# EAGLE schematic proiect (EAGLE 9.6.2)
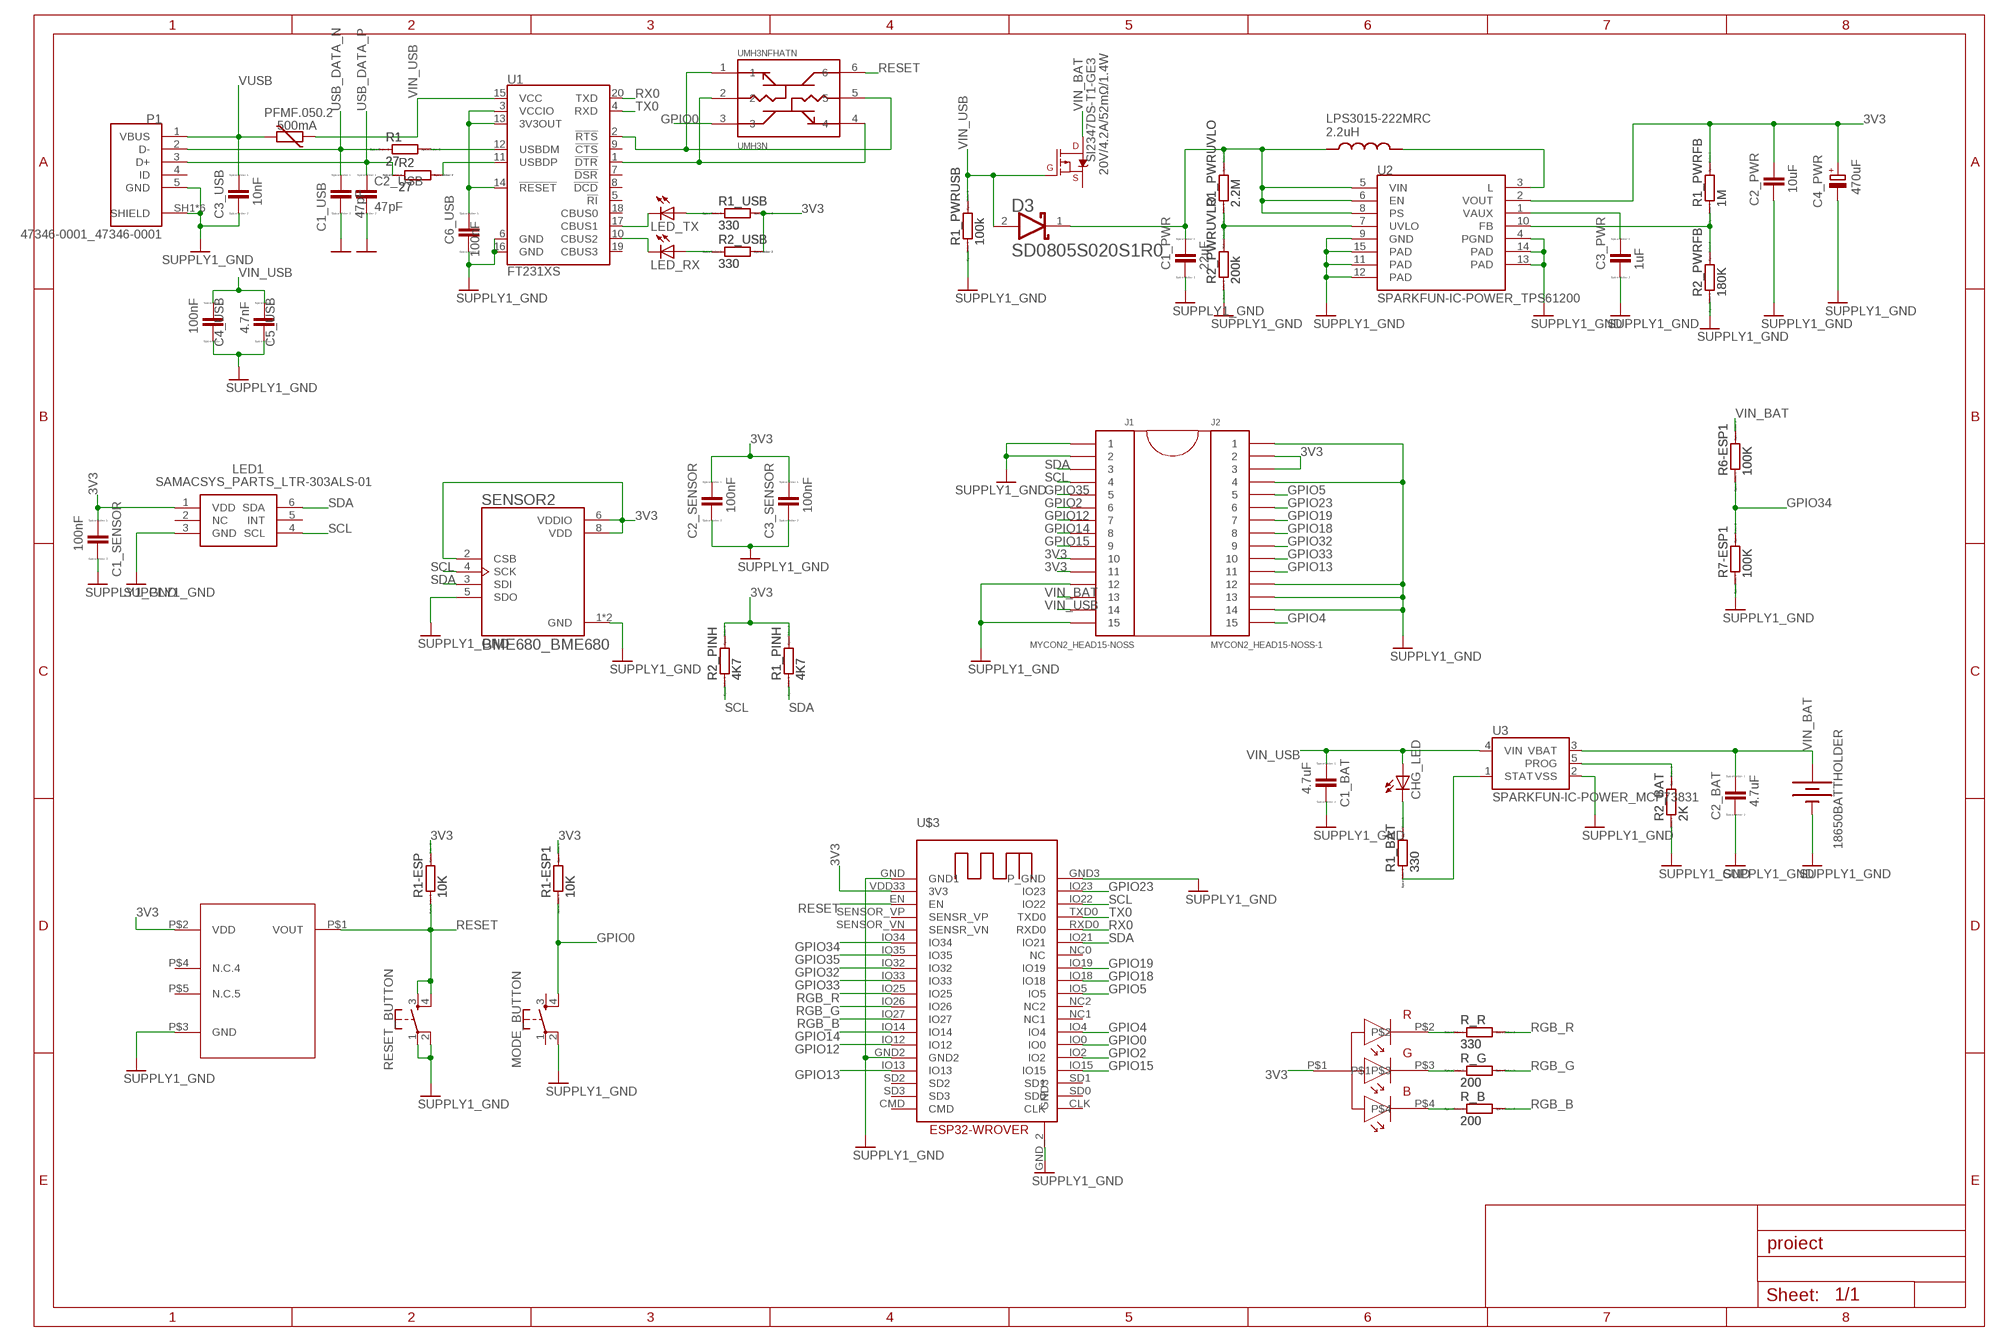
[diagram p0: schematic, sheet 1]

## Parts
18650BATTHOLDER  BATTERY-18650  [BATTERY_18650-HOLDER]
C1_BAT  4.7uF  EAGLE-LTSPICE_CC0402  [EAGLE-LTSPICE_C0402]
C1_PWR  22uF  EAGLE-LTSPICE_CC0402  [EAGLE-LTSPICE_C0402]
C1_SENSOR  100nF  EAGLE-LTSPICE_CC0402  [EAGLE-LTSPICE_C0402]
C1_USB  47pF  EAGLE-LTSPICE_CC0402  [EAGLE-LTSPICE_C0402]
C2_BAT  4.7uF  EAGLE-LTSPICE_CC0402  [EAGLE-LTSPICE_C0402]
C2_PWR  10uF  RCL_C-EUC0603  [RCL_C0603]
C2_SENSOR  100nF  EAGLE-LTSPICE_CC0402  [EAGLE-LTSPICE_C0402]
C2_USB  47pF  EAGLE-LTSPICE_CC0402  [EAGLE-LTSPICE_C0402]
C3_PWR  1uF  EAGLE-LTSPICE_CC0402  [EAGLE-LTSPICE_C0402]
C3_SENSOR  100nF  EAGLE-LTSPICE_CC0402  [EAGLE-LTSPICE_C0402]
C3_USB  10nF  EAGLE-LTSPICE_CC0402  [EAGLE-LTSPICE_C0402]
C4_PWR  470uF  RCL_CPOL-EUD/7343-31R  [RCL_D/7343-31R]
C4_USB  100nF  EAGLE-LTSPICE_CC0402  [EAGLE-LTSPICE_C0402]
C5_USB  4.7nF  EAGLE-LTSPICE_CC0402  [EAGLE-LTSPICE_C0402]
C6_USB  100nF  EAGLE-LTSPICE_CC0402  [EAGLE-LTSPICE_C0402]
CHG_LED  ADAFRUIT_LEDCHIP-LED0603  [ADAFRUIT_CHIP-LED0603]
D3  AVX---SD0805S020S1R0_AVX_SD0805S020S1R0AVX_SD0805S020S1R0_0_0  [AVX---SD0805S020S1R0_AVX_SD0805S020S1R0_0]
J1  MYCON2_HEAD15-NOSS  [MYCON2_HEAD15-NOSS]
J2  MYCON2_HEAD15-NOSS-1  [MYCON2_HEAD15-NOSS-1]
LED1  SAMACSYS_PARTS_LTR-303ALS-01  [SAMACSYS_PARTS_LTR303ALS01]
LED_RX  ADAFRUIT_LEDCHIP-LED0603  [ADAFRUIT_CHIP-LED0603]
LED_TX  ADAFRUIT_LEDCHIP-LED0603  [ADAFRUIT_CHIP-LED0603]
MODE_BUTTON  SPARKFUN-SWITCHES_MOMENTARY-SWITCH-SPST-2-SMD-4.6X2.8MM  [SPARKFUN-SWITCHES_TACTILE_SWITCH_SMD_4.6X2.8MM]
P1  47346-0001_47346-0001  [47346-0001_MOLEX_47346-0001]
PFMF.050.2  500mA  VARISTOR_VARISTORCN1812  [VARISTOR_CT/CN1812]
R1  27  EAGLE-LTSPICE_RR0402  [EAGLE-LTSPICE_R0402]
R1-ESP  10K  EAGLE-LTSPICE_RR0402  [EAGLE-LTSPICE_R0402]
R1-ESP1  10K  EAGLE-LTSPICE_RR0402  [EAGLE-LTSPICE_R0402]
R1_BAT  330  EAGLE-LTSPICE_RR0402  [EAGLE-LTSPICE_R0402]
R1_PINH  4K7  EAGLE-LTSPICE_RR0402  [EAGLE-LTSPICE_R0402]
R1_PWRFB  1M  EAGLE-LTSPICE_RR0402  [EAGLE-LTSPICE_R0402]
R1_PWRUSB  100k  EAGLE-LTSPICE_RR0402  [EAGLE-LTSPICE_R0402]
R1_PWRUVLO  2.2M  EAGLE-LTSPICE_RR0402  [EAGLE-LTSPICE_R0402]
R1_USB  330  EAGLE-LTSPICE_RR0402  [EAGLE-LTSPICE_R0402]
R2  27  EAGLE-LTSPICE_RR0402  [EAGLE-LTSPICE_R0402]
R2_BAT  2K  EAGLE-LTSPICE_RR0402  [EAGLE-LTSPICE_R0402]
R2_PINH  4K7  EAGLE-LTSPICE_RR0402  [EAGLE-LTSPICE_R0402]
R2_PWRFB  180K  EAGLE-LTSPICE_RR0402  [EAGLE-LTSPICE_R0402]
R2_PWRUVLO  200k  EAGLE-LTSPICE_RR0402  [EAGLE-LTSPICE_R0402]
R2_USB  330  EAGLE-LTSPICE_RR0402  [EAGLE-LTSPICE_R0402]
R6-ESP1  100K  EAGLE-LTSPICE_RR0402  [EAGLE-LTSPICE_R0402]
R7-ESP1  100K  EAGLE-LTSPICE_RR0402  [EAGLE-LTSPICE_R0402]
R_B  200  EAGLE-LTSPICE_RR0402  [EAGLE-LTSPICE_R0402]
R_G  200  EAGLE-LTSPICE_RR0402  [EAGLE-LTSPICE_R0402]
R_R  330  EAGLE-LTSPICE_RR0402  [EAGLE-LTSPICE_R0402]
RESET_BUTTON  SPARKFUN-SWITCHES_MOMENTARY-SWITCH-SPST-2-SMD-4.6X2.8MM  [SPARKFUN-SWITCHES_TACTILE_SWITCH_SMD_4.6X2.8MM]
SENSOR2  BME680_BME680  [BME680_PSON80P300X300X100-8N]
SI2347DS-T1-GE3  20V/4.2A/52mΩ/1.4W  SPARKFUN-DISCRETESEMI_MOSFET_PCH-DMG2305UX-7  [SPARKFUN-DISCRETESEMI_SOT23-3]
U1  FT231XS  SPARKFUN-IC-COMMS_FT231XS  [SPARKFUN-IC-COMMS_SSOP20_L]
U2  SPARKFUN-IC-POWER_TPS61200  [SPARKFUN-IC-POWER_QFN-10_PAD]
U3  SPARKFUN-IC-POWER_MCP73831  [SPARKFUN-IC-POWER_SOT23-5]
U$1  LPS3015_LPS3015  [LPS3015_LPS3015-222MRC]
U$2  BD48E27G-TR_BD48E27G-TR  [BD48E27G-TR_SSOP5]
U$3  ESP32-WROVER_ESP32-WROVER  [ESP32-WROVER_ESP32-WROVER]
U$4  150202M153130_150202M153130-RGB  [150202M153130_150202M153130]
UMH3NFHATN  UMH3N_UMH3N  [UMH3N_SOP65P210X100-6N]

## Nets
3V3: C1_SENSOR.1 C2_PWR.1 C2_SENSOR.1 C3_SENSOR.1 C4_PWR.+ J1.10 J1.11 J2.2 J2.3 LED1.1(VDD) R1-ESP1.2 R1-ESP.2 R1_PINH.2 R1_PWRFB.2 R1_USB.2 R2_PINH.2 R2_USB.2 SENSOR2.2(CSB) SENSOR2.6(VDDIO) SENSOR2.8(VDD) U2.2(VOUT) U$2.P$2(VDD) U$3.VDD33(3V3) U$4.P$1
GND: 18650BATTHOLDER.GND@1(-) C1_BAT.2 C1_PWR.2 C1_SENSOR.2 C1_USB.2 C2_BAT.2 C2_PWR.2 C2_SENSOR.2 C2_USB.2 C3_PWR.2 C3_SENSOR.2 C3_USB.2 C4_PWR.- C4_USB.2 C5_USB.2 C6_USB.2 J1.1 J1.2 J1.12 J1.15 J2.1 J2.4 J2.12 J2.13 J2.14 LED1.3(GND) MODE_BUTTON.2 P1.5(GND) P1.SH1(SHIELD) P1.SH2(SHIELD) P1.SH3(SHIELD) P1.SH4(SHIELD) P1.SH5(SHIELD) P1.SH6(SHIELD) R1_PWRUSB.1 R2_BAT.1 R2_PWRFB.1 R2_PWRUVLO.1 R7-ESP1.1 RESET_BUTTON.1 RESET_BUTTON.2 SENSOR2.1(GND) SENSOR2.5(SDO) SENSOR2.7(GND) U1.6(GND) U1.16(GND) U2.4(PGND) U2.9(GND) U2.11(PAD) U2.12(PAD) U2.13(PAD) U2.14(PAD) U2.15(PAD) U3.2(VSS) U$2.P$3(GND) U$3.GND2 U$3.GND3(P_GND) U$3.GND(GND1) U$3.GND_2(GND3) ; supply symbol labelled SUPPLY1_GND
GPIO0: MODE_BUTTON.4 R1-ESP1.1 U$3.IO0 UMH3NFHATN.3
GPIO2: J1.6 U$3.IO2
GPIO4: J2.15 U$3.IO4
GPIO5: J2.5 U$3.IO5
GPIO12: J1.7 U$3.IO12
GPIO13: J2.11 U$3.IO13
GPIO14: J1.8 U$3.IO14
GPIO15: J1.9 U$3.IO15
GPIO18: J2.8 U$3.IO18
GPIO19: J2.7 U$3.IO19
GPIO23: J2.6 U$3.IO23
GPIO32: J2.9 U$3.IO32
GPIO33: J2.10 U$3.IO33
GPIO34: R6-ESP1.1 R7-ESP1.2 U$3.IO34
GPIO35: J1.5 U$3.IO35
N$1: U1.2(!RTS) UMH3NFHATN.1 UMH3NFHATN.5
N$2: R1.2 U1.12(USBDM)
N$3: U1.1(!DTR) UMH3NFHATN.2 UMH3NFHATN.4
N$4: LED_TX.C U1.17(CBUS1)
N$5: R2.2 U1.11(USBDP)
N$6: C6_USB.1 U1.3(VCCIO) U1.13(3V3OUT) U1.14(!RESET)
N$7: LED_TX.A R1_USB.1
N$8: U2.3(L) U$1.P$2
N$9: LED_RX.A R2_USB.1
N$10: LED_RX.C U1.10(CBUS2)
N$11: R1_PWRUVLO.1 R2_PWRUVLO.2 U2.7(UVLO)
N$12: C3_PWR.1 U2.1(VAUX)
N$13: R1_PWRFB.1 R2_PWRFB.2 U2.10(FB)
N$14: R_R.1 U$4.P$2
N$15: CHG_LED.C R1_BAT.2
N$16: R1_BAT.1 U3.1(STAT)
N$17: R2_BAT.2 U3.5(PROG)
N$18: R_G.1 U$4.P$3
N$19: R_B.1 U$4.P$4
RESET: R1-ESP.1 RESET_BUTTON.3 RESET_BUTTON.4 U$2.P$1(VOUT) U$3.EN UMH3NFHATN.6
RGB_B: R_B.2 U$3.IO27
RGB_G: R_G.2 U$3.IO26
RGB_R: R_R.2 U$3.IO25
RX0: U1.20(TXD) U$3.RXD0
SCL: J1.4 LED1.4(SCL) R2_PINH.1 SENSOR2.4(SCK) U$3.IO22
SDA: J1.3 LED1.6(SDA) R1_PINH.1 SENSOR2.3(SDI) U$3.IO21
TX0: U1.4(RXD) U$3.TXD0
USB_DATA_N: C1_USB.1 P1.2(D-) R1.1
USB_DATA_P: C2_USB.1 P1.3(D+) R2.1
VIN: C1_PWR.1 D3.1(CATHODE) R1_PWRUVLO.2 U2.5(VIN) U2.6(EN) U2.8(PS) U$1.P$1
VIN_BAT: 18650BATTHOLDER.PWR@1(+) C2_BAT.1 J1.13 R6-ESP1.2 SI2347DS-T1-GE3.3(D) U3.3(VBAT)
VIN_USB: C1_BAT.1 C4_USB.1 C5_USB.1 CHG_LED.A D3.2(ANODE) J1.14 PFMF.050.2.1 R1_PWRUSB.2 SI2347DS-T1-GE3.1(G) U1.15(VCC) U3.4(VIN)
VUSB: C3_USB.1 P1.1(VBUS) PFMF.050.2.2
Unconnected: LED1.2(NC) LED1.5(INT) MODE_BUTTON.1 MODE_BUTTON.3 P1.4(ID) SI2347DS-T1-GE3.2(S) U1.5(!RI) U1.7(!DSR) U1.8(!DCD) U1.9(!CTS) U1.18(CBUS0) U1.19(CBUS3) U$2.P$4(N.C.4) U$2.P$5(N.C.5) U$3.CLK U$3.CMD U$3.NC0(NC) U$3.NC1 U$3.NC2 U$3.SD0 U$3.SD1 U$3.SD2 U$3.SD3 U$3.SENSOR_VN(SENSR_VN) U$3.SENSOR_VP(SENSR_VP)

## Library data of the parts
18650BATTHOLDER = SparkFun-Batteries:BATTERY: Battery - Single Cell A variety of battery chemistries, sizes, and footprints. Device List: 20MM_PTH - Coin Cell Battery Holder - 20mm (PTH) <https://www.sparkfun.com/products/783> 20MM_PTH_KIT- Coin Cell battery Holder - 20 mm (PTH) <http://www.sparkfun.com/products/783>kit version with special mask 6.8MM_PTH - Coin Cell Battery Holder - 6.8MM(SMD) <https://www.digikey.com/product-detail/en/seiko-instruments/MS621FE-FL11E/728-1057-ND/1889208?WT.srch=1&gclid=CNOQ5a6LzdQCFZS2wAodXCkE0g> 12MM_SMD - Coin Cell Battery Holder - 12mm (SMD) <https://www.sparkfun.com/products/10592> 12MM_PTH - Coin Cell Battery Holder - 12mm (PTH) <https://www.sparkfun.com/products/7948> 20MM_SMD - 20mm Coin Cell Battery Holder (SMD) (2 legs) Used on the Big Time Watch Kit <https://www.sparkfun.com/products/11734> 20MM_SMD_4LEGS - Coin Cell Battery Holder - 20mm (SMD) <https://www.sparkfun.com/products/11892> 20MM_SMD_4LEGS_OVERPASTE - Coin Cell Battery Holder - 20mm (SMD) <https://www.sparkfun.com/products/11892> (Over-paste on the legs) 24.5MM_PTH - Coin Cell Battery Holder - 24.5mm (PTH) <https://www.sparkfun.com/products/8863> 9V - 9V Battery Holder - PC Mount Used on the SparkFun SparkPunk Sound Kit <https://www.sparkfun.com/products/11177> and SparkFun SparkPunk Sequencer Kit <https://www.sparkfun.com/products/12707> 18650 - Battery Holder - 18650 (PTH) <https://www.sparkfun.com/products/13113> AA - Battery Holder - 1xAA (PTH) <https://www.sparkfun.com/products/7949> AAA - Battery Holder - 1xAAA (PTH) <https://www.sparkfun.com/products/12718> AA_KIT - Battery Holder - 1xAA (PTH) <https://www.sparkfun.com/products/7949> Special kit package - pads only have exposed copper on one side of the board. AAA_KIT - Battery Holder - 1xAAA (PTH) <https://www.sparkfun.com/products/12718> Special kit package - pads only have exposed copper on one side of the board.; PROD_ID: BATT-12327; SF_SKU: PRT-13113
C1_BAT C1_PWR C1_SENSOR C1_USB C2_BAT C2_SENSOR C2_USB C3_PWR C3_SENSOR C3_USB C4_USB C5_USB C6_USB = ESP32_WROVER:EAGLE-LTSPICE_C: CAPACITOR, European symbol; SPICEMODEL: NONE; SPICEPREFIX: C
C2_PWR = ESP32_WROVER:RCL_C-EU: CAPACITOR, European symbol; SPICEPREFIX: C
C4_PWR = ESP32_WROVER:RCL_CPOL-EU: POLARIZED CAPACITOR, European symbol; SPICEPREFIX: C
CHG_LED LED_RX LED_TX = ESP32_WROVER:ADAFRUIT_LED: LED OSRAM: - CHIPLED LG R971, LG N971, LY N971, LG Q971, LY Q971, LO R971, LY R971 LH N974, LH R974 LS Q976, LO Q976, LY Q976 LO Q996 - Hyper CHIPLED LW Q18S LB Q993, LB Q99A, LB R99A - SideLED LS A670, LO A670, LY A670, LG A670, LP A670 LB A673, LV A673, LT A673, LW A673 LH A674 LY A675 LS A676, LA A676, LO A676, LY A676, LW A676 LS A679, LY A679, LG A679 - Hyper Micro SIDELED® LS Y876, LA Y876, LO Y876, LY Y876 LT Y87S - SmartLED LW L88C, LW L88S LB L89C, LB L89S, LG L890 LS L89K, LO L89K, LY L89K LS L896, LA L896, LO L896, LY L896 - TOPLED LS T670, LO T670, LY T670, LG T670, LP T670 LSG T670, LSP T670, LSY T670, LOP T670, LYG T670 LG T671, LOG T671, LSG T671 LB T673, LV T673, LT T673, LW T673 LH T674 LS T676, LA T676, LO T676, LY T676, LB T676, LH T676, LSB T676, LW T676 LB T67C, LV T67C, LT T67C, LS T67K, LO T67K, LY T67K, LW E67C LS E67B, LA E67B, LO E67B, LY E67B, LB E67C, LV E67C, LT E67C LW T67C LS T679, LY T679, LG T679 LS T770, LO T770, LY T770, LG T770, LP T770 LB T773, LV T773, LT T773, LW T773 LH T774 LS E675, LA E675, LY E675, LS T675 LS T776, LA T776, LO T776, LY T776, LB T776 LHGB T686 LT T68C, LB T68C - Hyper Mini TOPLED® LB M676 - Mini TOPLED Santana® LG M470 LS M47K, LO M47K, LY M47K Source: http://www.osram.convergy.de/
D3 = ESP32_WROVER:AVX---SD0805S020S1R0_AVX_SD0805S020S1R0: Schottky Barrier Rectifier Diode; CENTROID_NOT_SPECIFIED: No; DATASHEET: http://datasheets.avx.com/schottky.pdf; DIGIKEY_DESCRIPTION: DIODE SCHOTTKY 20V 1A 0805; DIGIKEY_PART_NUMBER: 478-7800-1-ND; LEAD_FREE: yes; MF: AVX; MOUSER_PART_NUMBER: 581-SD0805S020S1R0; MPN: SD0805S020S1R0; PACKAGE: 0805 (2012 metric); PREFIX: D; ROHS: yes; TEMPERATURE_RANGE_HIGH: +125°C; TEMPERATURE_RANGE_LOW: -55°C
J1 = ESP32_WROVER:MYCON2_HEAD15-NOSS
J2 = ESP32_WROVER:MYCON2_HEAD15-NOSS-1
LED1 = ESP32_WROVER:SAMACSYS_PARTS_LTR-303ALS-01: Ambient Light Sensors Ambient Light Photo Sensor Source: Datasheet <http://optoelectronics.liteon.com/upload/download/DS86-2013-0004/LTR-303ALS-01_DS_V1.pdf>; ARROW_PART_NUMBER: LTR-303ALS-01; ARROW_PRICE-STOCK: https://www.arrow.com/en/products/ltr-303als-01/lite-on-technology?region=nac; DESCRIPTION: Ambient Light Sensors Ambient Light Photo Sensor; HEIGHT: 0mm; MANUFACTURER_NAME: Lite-On; MANUFACTURER_PART_NUMBER: LTR-303ALS-01; MOUSER_PART_NUMBER: 859-LTR-303ALS-01; MOUSER_PRICE-STOCK: https://www.mouser.co.uk/ProductDetail/Lite-On/LTR-303ALS-01?qs=Ml%2FaxAEbwm%252Bm%252BetMkBDC8g%3D%3D
MODE_BUTTON RESET_BUTTON = ESP32_WROVER:SPARKFUN-SWITCHES_MOMENTARY-SWITCH-SPST-2: Momentary Switch (Pushbutton) - SPST - Two Circuits Normally-open (NO) SPST momentary switches (buttons, pushbuttons). Schematic symbol includes two switch circuits. Variants SMD-4.6MMX2.8MM - 4.60mm x 2.80mm Tactile Momentary Button Switch - Used on SparkFun SAMD21 Mini Breakout <https://www.sparkfun.com/products/13664> SMD-5.2MM - Mini Pushbutton Switch - SMD <https://www.sparkfun.com/products/8720> - Used on Arduino Pro Mini <https://www.sparkfun.com/products/11114>; PROD_ID: SWCH-14139; SF_SKU: COM-08720
P1 = ESP32_WROVER:47346-0001_47346-0001: CONN RCPT 5POS MICRO USB R/A SMD Check prices <https://pricing.snapeda.com/parts/47346-0001/Molex/view-part?ref=eda>; AVAILABILITY: Warning; DESCRIPTION: USB - micro B USB 2.0 Receptacle Connector 5 Position Surface Mount, Right Angle; MF: Molex; MP: 47346-0001; PACKAGE: None; PRICE: None
PFMF.050.2 = ESP32_WROVER:VARISTOR_VARISTOR: VARISTOR
R1 R1-ESP R1-ESP1 R1_BAT R1_PINH R1_PWRFB R1_PWRUSB R1_PWRUVLO R1_USB R2 R2_BAT R2_PINH R2_PWRFB R2_PWRUVLO R2_USB R6-ESP1 R7-ESP1 R_B R_G R_R = ESP32_WROVER:EAGLE-LTSPICE_R*?: RESISTOR, European symbol; SPICEMODEL: NONE; SPICEPREFIX: R
SENSOR2 = ESP32_WROVER:BME680_BME680: Integrated Environmental Unit; AVAILABILITY: Unavailable; DESCRIPTION: Integrated Environmental Unit; MF: Bosch Sensortec; MP: BME680; PACKAGE: LGA-8 Bosch Tools; PRICE: None
SI2347DS-T1-GE3 = ESP32_WROVER:SPARKFUN-DISCRETESEMI_MOSFET_PCH: P-channel MOSFETs Voltage controlled devices that allow control of high current outputs. SparkFun Products: SparkFun ESP32 Thing <https://www.sparkfun.com/products/13907> SparkFun ESP8266 Thing <https://www.sparkfun.com/products/13231> SparkFun Pi Servo HAT V2 <https://www.sparkfun.com/products/15316> DMG2305UX-7 (20V/4.2A/SOT23-3); PROD_ID: TRAN-14388
U1 = ESP32_WROVER:SPARKFUN-IC-COMMS_FT231X: FTDI FT231X Full Speed USB to Full-handshake UART This USB2.0 Full Speed IC offers a compact bridge to full handshake UART interfaces. The device is a UART, capable of operating up to 3MBaud, with low power consumption (8mA). The FT231X includes the complete FT-X series feature set and enables USB to be added into a system design quickly and easily over a UART interface. Datasheet <http://cdn.sparkfun.com/datasheets/Components/General%20IC/DS_FT231X.pdf> SparkFun Products SparkFun RedBoard - Programmed with Arduino <https://www.sparkfun.com/products/12757> (DEV-12757) SparkFun XBee Explorer USB <https://www.sparkfun.com/products/11812> (WRL-11812) SparkFun XBee Explorer Dongle <https://www.sparkfun.com/products/11697> (WRL-11697) SparkFun Blynk Board - ESP8266 <https://www.sparkfun.com/products/13794> (WRL-13794) SparkFun ESP8266 Thing - Dev Board <https://www.sparkfun.com/products/13711> (WRL-13711) SparkFun Block for Intel® Edison - Base <https://www.sparkfun.com/products/13045> (DEV-13045) SparkFun RedStick <https://www.sparkfun.com/products/13741> (DEV-13741) SparkFun Beefy 3 - FTDI Basic Breakout <https://www.sparkfun.com/products/13746> (DEV-13746) SparkFun FT231X Breakout <https://www.sparkfun.com/products/11736> (BOB-11736); PROD_ID: IC-11524
U2 = ESP32_WROVER:SPARKFUN-IC-POWER_TPS61200: DC to DC Booster IC-10035; PROD_ID: IC-10035
U3 = ESP32_WROVER:SPARKFUN-IC-POWER_MCP73831: MCP73831T Li-Ion, Li-Pol Controller Miniature single cell, fully integrated Li-Ion, Li-polymer charge management controller Datasheet <http://ww1.microchip.com/downloads/en/DeviceDoc/20001984g.pdf> SparkFun Products: SparkFun ESP32 Thing <https://www.sparkfun.com/products/13907> SparkFun 9DoF Razor IMU M0 <https://www.sparkfun.com/products/14001>; PROD_ID: IC-09995
U$1 = ESP32_WROVER:LPS3015_LPS3015
U$2 = ESP32_WROVER:BD48E27G-TR_BD48E27G-TR
U$3 = ESP32_WROVER:ESP32-WROVER_ESP32-WROVER
U$4 = ESP32_WROVER:150202M153130_150202M153130-RGB
UMH3NFHATN = ESP32_WROVER:UMH3N_UMH3N: Dual PNP/NPN transistor for chip reset; AVAILABILITY: Unavailable; DESCRIPTION: Pre-Biased Bipolar Transistor (BJT) 2 NPN - Pre-Biased (Dual) 50V 100mA 250MHz 150mW Surface Mount UMT6; MF: Rohm; MP: UMH3N; PACKAGE: SOT-363 Rohm; PRICE: None